# EAGLE design SMA-Q2 replacement board v2.1 (EAGLE 8.6.0)
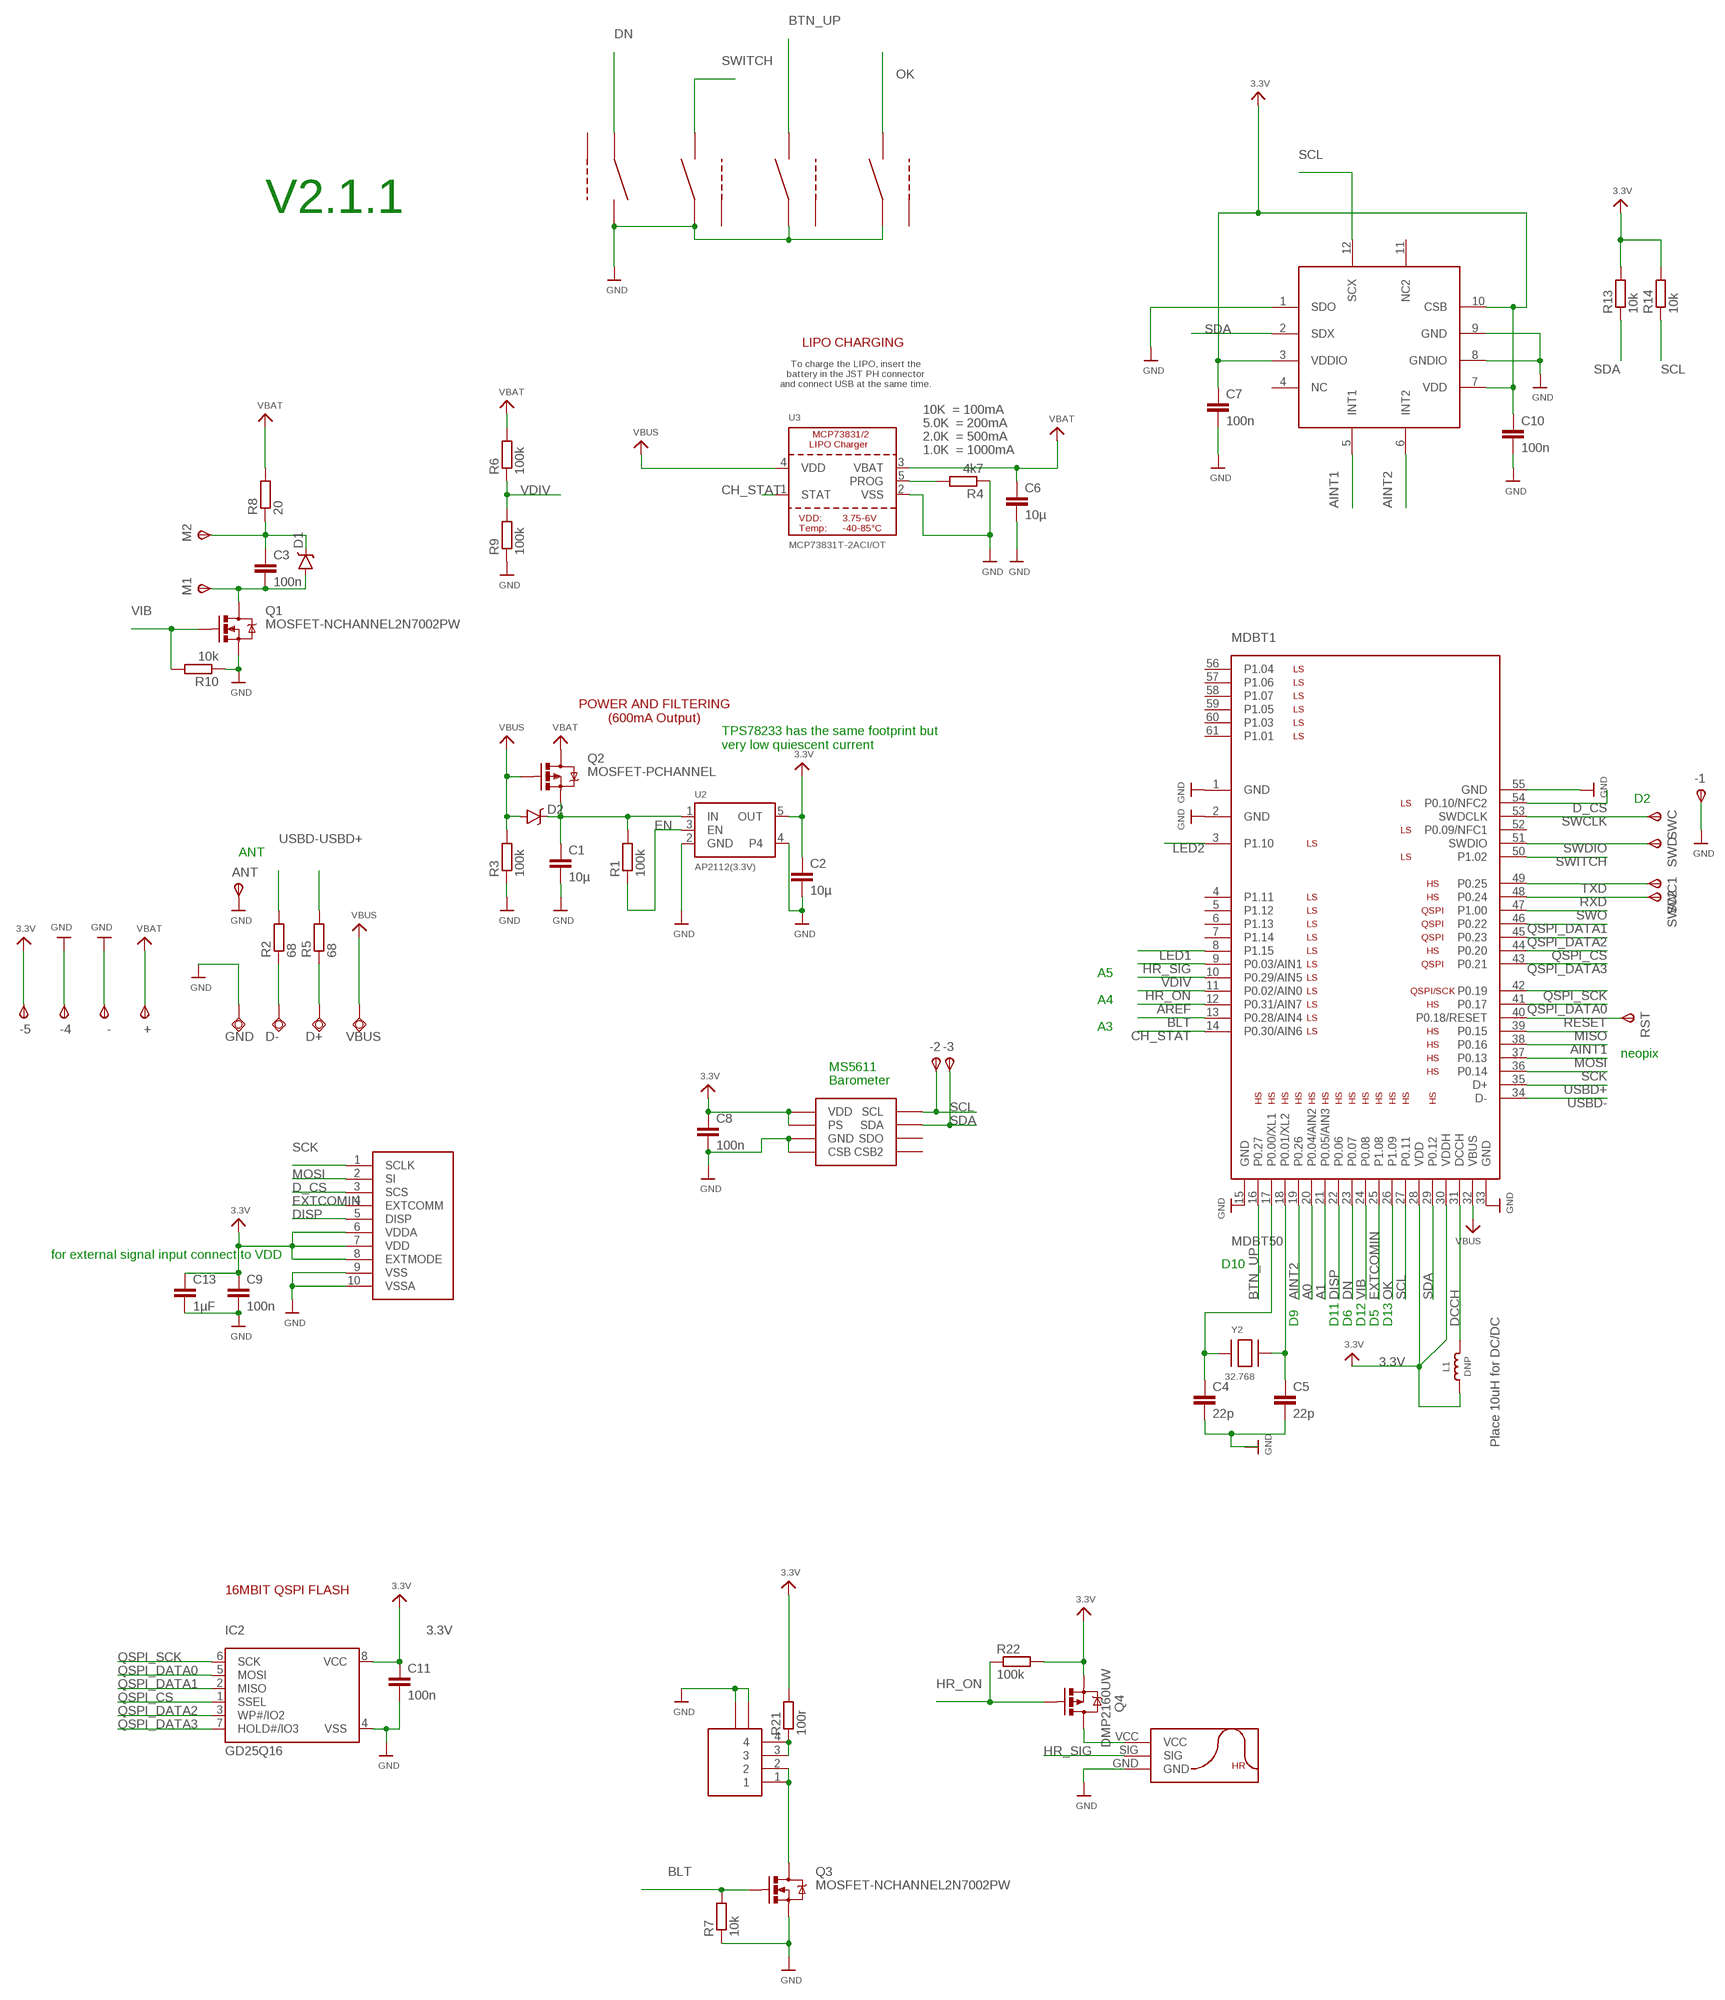
[diagram p0: schematic, sheet 1]

## Parts
+  TPSTP09R  [TP09R]
-  TPSTP09R  [TP09R]
-1  TPSTP09R  [TP09R]
-2  TPSTP09R  [TP09R]
-3  TPSTP09R  [TP09R]
-4  TPSTP09R  [TP09R]
-5  TPSTP09R  [TP09R]
ANT  TPSTP19SQ  [TP19SQ]
C1  10µ  C-EUC0603  [C0603]
C2  10µ  C-EUC0603  [C0603]
C3  100n  C-EUC0402  [C0402]
C4  22p  C-EUC0402  [C0402]
C5  22p  C-EUC0402  [C0402]
C6  10µ  C-EUC0603  [C0603]
C7  100n  C-EUC0402  [C0402]
C8  100n  C-EUC0402  [C0402]
C9  100n  C-EUC0402  [C0402]
C10  100n  C-EUC0402  [C0402]
C11  100n  C-EUC0402  [C0402]
C13  1µF  C-EUC0402  [C0402]
D1  BAT20J  DIODE-SCHOTTKY-BAT20J  [SOD-323]
D2  BAT20J  DIODE-SCHOTTKY-BAT20J  [SOD-323]
D+  TPSQTP20R  [TP20R]
D-  TPSQTP20R  [TP20R]
DWN  LS12T2  [LS12T2]
DWN1  LS12T2  [LS12T2]
DWN2  LS12T2  [LS12T2]
DWN3  LS12T2  [LS12T2]
GND  TPSQTP20R  [TP20R]
IC2  GD25Q16  SPIFLASH_8PINUX  [USON8]
L1  DNP  INDUCTOR_0805MP  [_0805MP]
M1  TPSTP09R  [TP09R]
M2  TPSTP09R  [TP09R]
MDBT1  MDBT50  [MDBT50]
Q1  MOSFET-NCHANNEL2N7002PW  [SOT323]
Q2  MOSFET-PCHANNEL  [SOT23-3]
Q3  MOSFET-NCHANNEL2N7002PW  [SOT323]
Q4  DMP2160UW  MOSFET-P-CHANNEL-DMP2160UW  [SOT323]
R1  100k  R-EU_R0402  [R0402]
R2  68  R-EU_R0402  [R0402]
R3  100k  R-EU_R0402  [R0402]
R4  4k7  R-EU_R0402  [R0402]
R5  68  R-EU_R0402  [R0402]
R6  100k  R-EU_R0402  [R0402]
R7  10k  R-EU_R0402  [R0402]
R8  20  R-EU_R0402  [R0402]
R9  100k  R-EU_R0402  [R0402]
R10  10k  R-EU_R0402  [R0402]
R13  10k  R-EU_R0402  [R0402]
R14  10k  R-EU_R0402  [R0402]
R21  100r  R-EU_R0402  [R0402]
R22  100k  R-EU_R0402  [R0402]
RST  TPSTP09R  [TP09R]
SWC  TPSTP09R  [TP09R]
SWC1  TPSTP09R  [TP09R]
SWC2  TPSTP09R  [TP09R]
SWD  TPSTP09R  [TP09R]
U2  AP2112(3.3V)  VREG_SOT23-5  [SOT23-5]
U3  MCP73831T-2ACI/OT  MCP73831/2  [SOT23-5]
U$2  SHARP_MEM_DISP  [Y5BW]
U$6  Y5B-4PIN  [Y5B-4PIN]
U$7  BMA400  [BMA400]
U$15  MC5611  [MS5611]
U$45  HR_PADS  [HR_PADS]
VBUS  TPSQTP20R  [TP20R]
Y2  32.768  XTAL-3.2X1.5  [XTAL3215]

## Nets
3.3V [power]: -5.TP(PP) C2.1 C7.1 C8.1 C9.1 C10.1 C11.1 C13.1 IC2.8(VCC) L1.1 MDBT1.28(VDD) MDBT1.30(VDDH) Q4.2(S) R13.2 R14.2 R21.2 R22.2 U2.5(OUT) U$2.6(VDDA) U$2.7(VDD) U$2.8(EXTMODE) U$7.3(VDDIO) U$7.7(VDD) U$7.10(CSB) U$15.PS U$15.VDD
A0: MDBT1.20(P0.04/AIN2)
A1: MDBT1.21(P0.05/AIN3)
AINT1: MDBT1.38(P0.16) U$7.5(INT1)
AINT2: MDBT1.19(P0.26) U$7.6(INT2)
AREF: MDBT1.12(P0.31/AIN7)
BLT: MDBT1.13(P0.28/AIN4) Q3.1(G) R7.2
BTN_UP: DWN2.1 MDBT1.16(P0.27)
CH_STAT: MDBT1.14(P0.30/AIN6) U3.1(STAT)
D_CS: MDBT1.54(P0.10/NFC2) U$2.3(SCS)
DCCH: L1.2 MDBT1.31(DCCH)
DISP [power]: MDBT1.22(P0.06) U$2.5(DISP)
DN: DWN.2 MDBT1.23(P0.07)
EN: R1.1 U2.3(EN)
EXTCOMIN: MDBT1.25(P1.08) U$2.4(EXTCOMM)
GND: -1.TP(PP) -4.TP(PP) -.TP(PP) ANT.TP(PP) C1.2 C2.2 C4.2 C5.2 C6.2 C7.2 C8.2 C9.2 C10.2 C11.2 C13.2 DWN1.2 DWN2.2 DWN3.2 DWN.1 GND.TP IC2.4(VSS) MDBT1.1(GND) MDBT1.2(GND) MDBT1.15(GND) MDBT1.33(GND) MDBT1.55(GND) Q1.2(S) Q3.2(S) R3.1 R4.1 R7.1 R9.1 R10.1 U2.2(GND) U2.4 U3.2(VSS) U$2.9(VSS) U$2.10(VSSA) U$6.H1 U$6.H2 U$7.1(SDO) U$7.8(GNDIO) U$7.9(GND) U$15.CSB U$15.GND U$45.GND
HR_ON: MDBT1.11(P0.02/AIN0) Q4.1(G) R22.1
HR_SIG: MDBT1.9(P0.03/AIN1) U$45.SIG
LED1: MDBT1.8(P1.15)
LED2: MDBT1.3(P1.10)
MISO: MDBT1.39(P0.15)
MOSI: MDBT1.37(P0.13) U$2.2(SI)
N$1: Q3.3(D) U$6.1 U$6.2
N$3: D-.TP R2.1
N$4: D+.TP R5.1
N$7: C4.1 MDBT1.17(P0.00/XL1) Y2.P$1
N$8: C5.1 MDBT1.18(P0.01/XL2) Y2.P$2
N$9: R21.1 U$6.3 U$6.4
N$12: R4.2 U3.5(PROG)
N$13: C3.2 D1.A M1.TP(PP) Q1.3(D)
N$14: C3.1 D1.C M2.TP(PP) R8.1
N$17: Q4.3(D) U$45.VCC
OK: DWN3.1 MDBT1.26(P1.09)
QSPI_CS: IC2.1(SSEL) MDBT1.44(P0.20)
QSPI_DATA0: IC2.5(MOSI) MDBT1.41(P0.17)
QSPI_DATA1: IC2.2(MISO) MDBT1.46(P0.22)
QSPI_DATA2: IC2.3(WP#/IO2) MDBT1.45(P0.23)
QSPI_DATA3: IC2.7(HOLD#/IO3) MDBT1.43(P0.21)
QSPI_SCK: IC2.6(SCK) MDBT1.42(P0.19)
RESET: MDBT1.40(P0.18/RESET) RST.TP(PP)
RXD: MDBT1.48(P0.24) SWC2.TP(PP)
SCK: MDBT1.36(P0.14) U$2.1(SCLK)
SCL: -2.TP(PP) MDBT1.27(P0.11) R14.1 U$7.12(SCX) U$15.SCL
SDA: -3.TP(PP) MDBT1.29(P0.12) R13.1 U$7.2(SDX) U$15.SDA
SWCLK: MDBT1.53(SWDCLK) SWC.TP(PP)
SWDIO: MDBT1.51(SWDIO) SWD.TP(PP)
SWITCH: DWN1.1 MDBT1.50(P1.02)
SWO: MDBT1.47(P1.00)
TXD: MDBT1.49(P0.25) SWC1.TP(PP)
USBD+: MDBT1.35(D+) R5.2
USBD-: MDBT1.34(D-) R2.2
VBAT [power]: +.TP(PP) C6.1 Q2.3(D) R6.2 R8.2 U3.3(VBAT)
VBUS [power]: D2.A MDBT1.32(VBUS) Q2.1(G) R3.2 U3.4(VDD) VBUS.TP
VDIV: MDBT1.10(P0.29/AIN5) R6.1 R9.2
VHI [power]: C1.1 D2.C Q2.2(S) R1.2 U2.1(IN)
VIB: MDBT1.24(P0.08) Q1.1(G) R10.2
Unconnected: DWN1.FRAME(FRM) DWN2.FRAME(FRM) DWN3.FRAME(FRM) DWN.FRAME(FRM) MDBT1.4(P1.11) MDBT1.5(P1.12) MDBT1.6(P1.13) MDBT1.7(P1.14) MDBT1.52(P0.09/NFC1) MDBT1.56(P1.04) MDBT1.57(P1.06) MDBT1.58(P1.07) MDBT1.59(P1.05) MDBT1.60(P1.03) MDBT1.61(P1.01) U$7.4(NC) U$7.11(NC2) U$15.CSB2 U$15.SDO

## Notes on the sheet
- V2.1.1
- LIPO CHARGING
- To charge the LIPO, insert the
  battery in the JST PH connector
  and connect USB at the same time.
- 10K  = 100mA
- 5.0K  = 200mA
- 2.0K  = 500mA
- 1.0K  = 1000mA
- POWER AND FILTERING
  (600mA Output)
- TPS78233 has the same footprint but 
  very low quiescent current
- D2
- ANT
- A5
- A4
- A3
- neopix
- MS5611
- Barometer
- for external signal input connect to VDD | D10
- D9 | D11 | D6 | D12 | D5 | D13
- Place 10uH for DC/DC
- 16MBIT QSPI FLASH

## Library data of the parts
+ - -1--5 ANT M1 M2 RST SWC SWC1 SWC2 SWD = testpad:TPS: TEST PIN
C1-C11 C13 = rcl:C-EU: CAPACITOR, European symbol
D1 D2 = SparkFun-DiscreteSemi:DIODE-SCHOTTKY: Schottky diodes in SFE's production catalog BAT20J 1A 23V 0.62Vf RB751 120mA 40V 0.37Vf PMEG4005EJ 0.5A 40V 0.42Vf MBRA140 1A 40V 0.5Vf B340A 3A 40V SMA; PROD_ID: DIO-11623
D+ D- GND VBUS = testpad:TPSQ: Test pad
DWN DWN1-DWN3 = LS12T2:LS12T2
IC2 = microbuilder:SPIFLASH_8PIN: SOIC8 SPI Flash Be careful with the size since SOIC8 flash comes in several 'widths' SOIC8 150 mil M25P16 - 16Mbit (2Mbit x 8) Serial Flash (75MHz SPI Bus), Supply: 2.7-3.6V Digikey: SOIC8 - M25P16-VMN6P-ND SOIC8 208 mil W25Q16BVSSIG - 16Mbit (2Mbit x 8) Serial Flash (104MHz SPI Bus), Supply: 2.7-3.6V Digikey: SOIC8 - W25Q16BVSSIG-ND
L1 = microbuilder:INDUCTOR: Inductors 0603: 10nH Ceramic Inductor - microwire antenna/RF (Digikey: 712-1434-2-ND) 0805: 560nH Ceramic Inductor - RF (Digikey: 553-1047-1-ND) 270nH Ceramic Inductor - Q = 40@250MHz, +-5%, 1 Ohm DC Resistance (Digikey: 535-10506-2-ND) 1007 (2518 Metric) SMT: 10µH 10% 250mOhm 820mA 1007 Inductor (Digikey: 587-2189-1-ND) 22µH 10% 500mOhm 580mA 1007 Inductor (Digikey: 587-2190-1-ND) 47µH 10% 950mOhm 420mA 1007 Inductor (Digikey: 587-2191-1-ND) 47µH 5% 100mOhm 1A 1008 Inductor (Digikey: 732-1816-1-ND) 5.0x5.0mm (Taiyo Yuden NR5040 Series) 6.8µH 20% 2.3A 64mOhm Inductor (Digikey: 587-2374-2-ND) 5.0x5.0mm (TDK VLC5045 Series) 4.7µH 20% 3.3A 34mOhm Inductor (Digikey: 445-6526-1-ND) 6.8µH 20% 2.7A 46mOhm Inductor (Digikey: 445-6527-1-ND) 6.0x6.0mm (TDK VLC6045 Series) 4.7µH 20% 3.8A 27mOhm Inductor (Digikey: 445-6538-2-ND) 6.8µH 20% 3A 41mOhm Inductor (Digikey: 445-6540-1-ND) 6.2µH 30% 2.2A 45mOhm Inductor (Digikey: SRR5028-6R2YCT-ND) - Not TDK VLC6045 but footprint should match 6.0x6.0mm (TDK SLF6045 Series) 6.8uH 30% 2A 33mOhm Inductor (Digikey: 445-4572-1-ND, Mouser: 810-SLF645T6R8N2R0PF) 6.0x6.0mm (Sumida CDRH5D28 Series) 6.2uH 30% 1.8A 45mOhm Inductor (Digikey: 308-1542-1-ND) Taiyo Yuden NR3015T2R2M - 2.2uH 20% 1.5A (Digikey: 587-1648-2-ND, Mouser: 963-NR3015T2R2M) - Used with TI TPS62172 CoilCraft RFID Transponder Coil - MA5532-AE (For use with AS3935 Lightning Sensor) Taiyo Yuden NRH2412T2R2MNGH - 2.2uH 20% 1AA (Digikey: 587-3443-1-ND) - Used with TI LM3671 Vishay IHLP 1.0uH Molded Inductor - 24mOhm DCR, 5A, +/-20%, -55°C-125°C (Digikey: 541-1319-1-ND)
MDBT1 = microbuilder:MDBT50: Raytac Corporation MDBT50 Bluetooth Low Energy Module based on Noridc nRF52840 Source: Raytac datasheet
Q1 Q3 = SparkFun-DiscreteSemi:MOSFET-NCHANNEL: Common NMOSFET Parts MFG P/N Store ID Prod ID FDD8780 TRANS-09984 SI7820DN TRANS-11055 FDS6630A IC-08089 2N7002PW TRANS-11151 FQP30N06L COM-10213 TRANS-10060 BSS123LT1G TRANS-08345 BSS138 TRANS-00830 BS170 2N7000; PROD_ID: TRANS-11151
Q2 = SparkFun-DiscreteSemi:MOSFET-PCHANNEL: Generic PMOSFET IRLML2244 - TRANS-11153 (SOT-23 -20V -4.3A) (1.Gate 2.Source 3.Drain) FQP27P06 - COM-10349 <http://www.sparkfun.com/products/10349> (TO-220 -60V -27A) (1.Gate 2.Source 3.Drain); PROD_ID: TRANS-08285
Q4 = TSEM_R2A:MOSFET-P-CHANNEL: MOSFET P Channel; FARNELL_OC: 1858672
R1-R10 R13 R14 R21 R22 = rcl:R-EU_: RESISTOR, European symbol
U2 = microbuilder:VREG_SOT23-5: SOT23-5 Fixed Voltage Regulators Part Current Out V Out V In V Dropout θJA (°C/W) TJ (°C) Digikey Part No. ADP121 150mA 3.3V 3.4-5.5V 0.09V @ 150mA -- -- ADP121-AUJZ33R7CT-ND ADP121 150mA 3.0V 3.1-5.5V 0.09V @ 150mA -- -- ADP121-AUJZ30R7CT-ND ADP122 300mA 3.3V 3.4-5.5V 0.085V @ 300mA -- -- ADP122AUJZ-3.3-R7CT-ND ADP1712 300mA 3.3V 3.5-5.5V 0.17V @ 300mA -- -- ADP1712AUJZ-3.3-R7TR-ND AP7311 (Low Cost) 150mA 3.3V 3.5-6V 0.15V @ 150mA -- -- AP7311-33WG-7DICT-ND LD39015M18R 150mA 1.8V 1.9V-5.5V 0.08V @ 100mA -- -- 497-6977-1-ND LP2985A-33DBVR 150mA 3.3V 3.3-16V 0.28V @ 150mA 206 150 296-18479-1-ND MCP1824T-3302E/OT 300mA 3.3V 3.5V-6V 0.2V @ 300mA -- -- MCP1824T-3302E/OTCT-ND MIC5205-2.5YM5 TR 150mA 2.5V 2.7-16V 0.165V @ 150mA -- -- 576-1257-2-ND MIC5205-3.0YM5 TR 150mA 3.0V 3.2V-16V 0.165V @ 150mA -- -- 576-1258-2-ND MIC5205-3.3YM5 TR 150mA 3.3V 3.5V-16V 0.165V @ 150mA -- -- 576-1259-2-ND TPS780330220 150mA 3.3V+2.2V 3.6-5.5V 250mV Max -- -- 296-23332-1-ND TDA3663/N1,135 100mA 3.3V 3.5-45V 0.18V @ 50mA -- -- 568-5343-1-ND Max operating temp can be calculated using θJA, TJ (max junction temperature), and power in watts. Set the "Maximum Ambient Temperature" until it reaches TJ ("Max Junction Temperature"), which is the absolute limit for safe use of the regulator: Heat Sink Temperature Calculator <http://www.daycounter.com/Calculators/Heat-Sink-Temperature-Calculator.phtml> For example, With 12V source into a 3.3V LP2985 and a 30mA load, we are dissipating (12V-3.3V) * 0.03A = 0.261W. With a θJA of 206 °C/W, a TJ of 150°C, and 261mW we can safely use the chip without a heat sink up to 75°C (=147.1°C Junction Temperature).
U3 = microbuilder:MCP73831/2: MCP73831/2 LIPO Charger VDD: 3.75 - 6V Temp -40 - 85°C Programmable Charge Rate: 15-500mA NOTE: STAT is a tri-state logic output on the MCP73831 and an open-drain output on the MCP73832. SOT23-5 with 4.2V output and tri-state logic on STAT = MCP73831T-2ACI/OT
U$2 = AYF531035:SHARP_MEM_DISP
U$6 = Y5B-4pin:Y5B-4PIN
U$7 = BMA400:BMA400
U$15 = MS5611:MC5611
U$45 = HR_pads:HR_PADS
Y2 = adafruit2:XTAL: Low cost SMT crystals, no capacitors included http://www.ladyada.net/library/eagle

## Net classes
1 power: width 0.254 mm

## Board
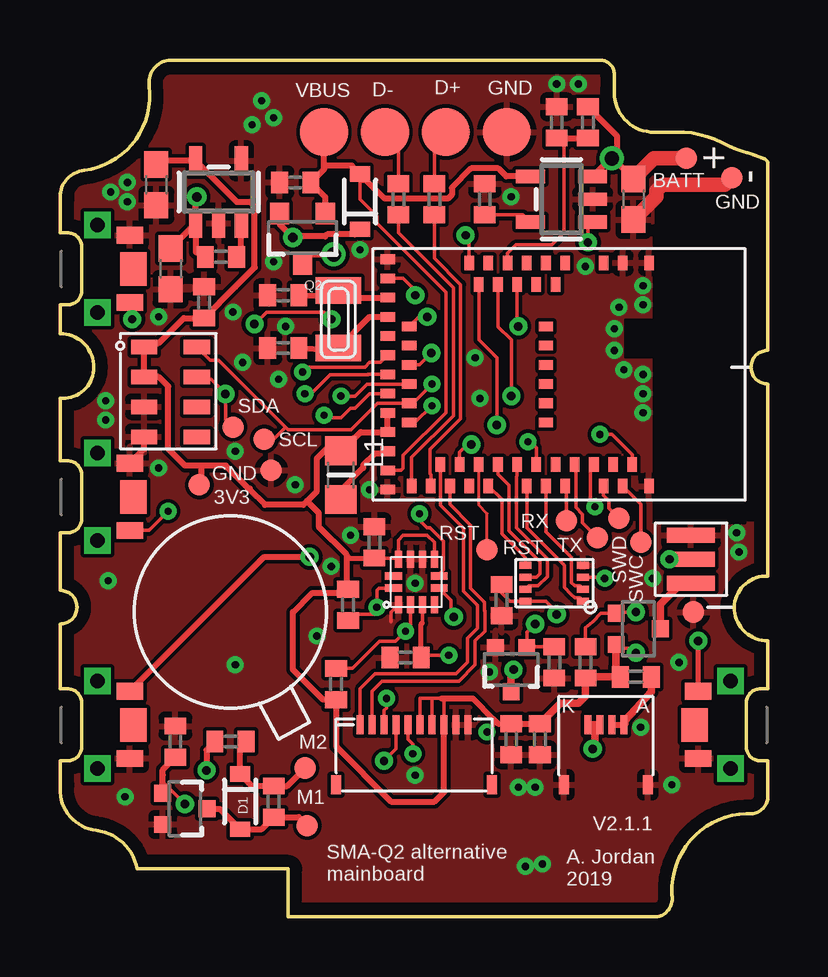
[diagram p1: board, top side]
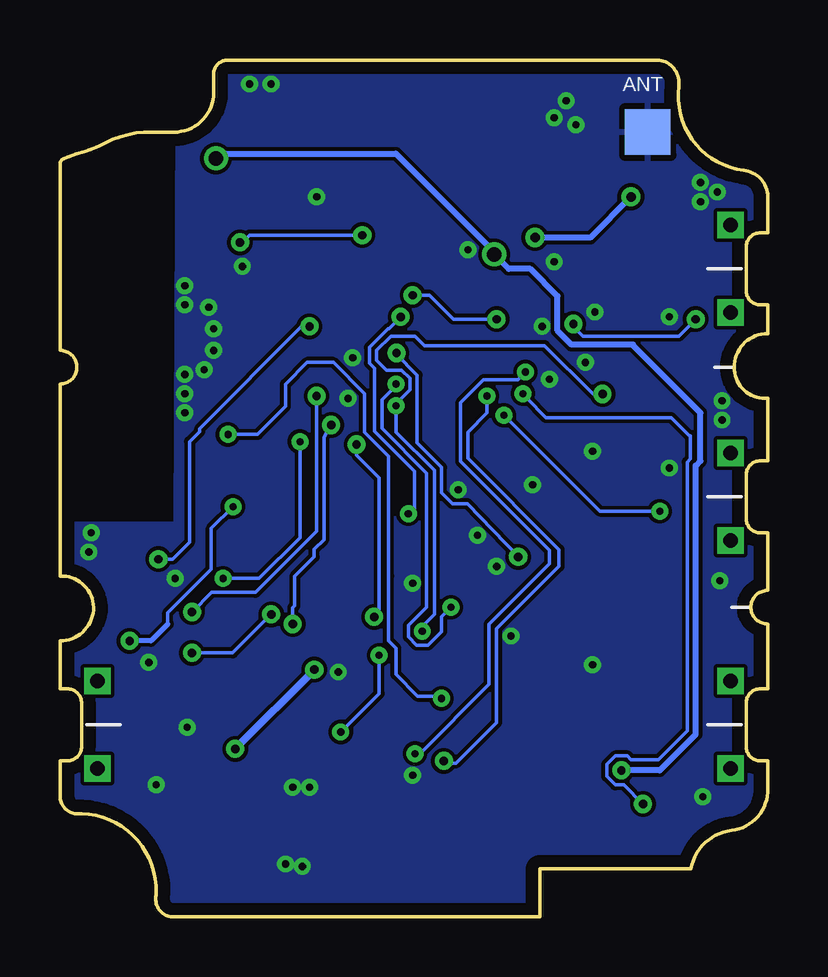
[diagram p2: board, bottom side, seen from below]

Size 29.52 x 35.7 mm. Coordinates in mm from the lower left corner, seen from the top.
Outline: 0.01,5.5 0.01,6.5 0.31,6.5 arc90 0.91,7.1 0.91,8.9 arc90 0.31,9.5 0.01,9.5 0.01,12.2 arc90 0.71,12.9 arc90 0.01,13.6 0.01,16 0.31,16 arc90 0.91,16.6 0.91,18.4 arc90 0.31,19 0.01,19 0.01,21.6 0.11,21.6 arc90 1.41,22.9 arc90 0.01,24.3 0.01,25.5 0.31,25.5 arc90 0.91,26.1 0.91,27.9 arc90 0.31,28.5 0.01,28.5 0.01,29.9 arc-90 1.01,31.1 arc90 3.71,34.6 3.71,34.7 arc-90 4.61,35.7 22.51,35.7 arc-90 23.11,35.1 23.11,34.5 arc90 24.61,32.7 26.01,32.7 arc-25 27.91,32.1 arc8 28.81,31.8 29.31,31.6 arc-90 29.51,31.3 29.51,23.6 arc90 28.81,22.9 arc90 29.51,22.2 29.51,14.2 arc90 28.11,12.9 arc90 29.51,11.5 29.51,9.5 29.21,9.5 arc90 28.61,8.9 28.61,7.1 arc90 29.21,6.5 29.51,6.5 29.51,4.9 arc-90 28.61,4.3 arc90 25.51,1 25.51,0.9 arc-90 24.91,0 9.51,0 9.51,2 3.21,2 arc73 1.51,3.6 arc-90 0.01,5.5
Copper layers (1*16): Top 0.035mm / dielectric 1.5mm / Bottom 0.035mm
Design rules "default *": minimum track width 6mil, minimum drill 0.35mm, track to track 6mil, track to pad 6mil, pad to pad 6mil, via to via 6mil, smd to smd 6mil, copper to edge 20mil, drill to drill 6mil, minimum pad ring 10mil, minimum via ring 8mil, stop-mask expansion 4mil, vias tented up to drill 20mil, thermal gap 10mil

### Footprints (pad centres in the part's own frame; a part is rotated, then mirrored left to right if it is on the bottom)
TP09R = smd 0.9 x 0.9: TP 0,0
TP19SQ = smd 1.9 x 1.9: TP 0,0
C0603 = smd 1.1 x 1: 1 -0.85,0; 2 0.85,0
C0402 = smd 0.7 x 0.9: 1 -0.65,0; 2 0.65,0
SOD-323 = smd 0.63 x 0.83: A 1.15,0; C -1.15,0
TP20R = smd 2 x 2: TP 0,0
LS12T2 = smd 1.1 x 0.7: 1 0,1.4; 2 0,-1.4 | smd 1.1 x 1.4: FRAME -0.15,0 | drill 0.6 pad 1.016 square: P$4 1.35,-1.825; P$5 1.35,1.825
USON8 = smd 0.5 x 0.275: 1 -1.2,0.75; 2 -1.2,0.25; 3 -1.2,-0.25; 4 -1.2,-0.75; 5 1.2,-0.75; 6 1.2,-0.25; 7 1.2,0.25; 8 1.2,0.75
_0805MP = smd 1.2 x 1.3: 1 -1.016,0; 2 1.016,0
MDBT50 = smd 0.6 x 0.4: 1 -4.65,3.75; 2 -4.65,2.65; 3 -4.65,1.85; 4 -4.65,0.25; 5 -3.75,-0.15; 6 -4.65,-0.55; 7 -3.75,-0.95; 8 -4.65,-1.35; 9 -3.75,-1.75; 10 -4.65,-2.15; 11 -3.75,-2.55; 12 -4.65,-2.95; 13 -3.75,-3.35; 14 -4.65,-3.75; 34 4.65,-6.15; 35 4.65,-5.35; 36 3.75,-4.95; 37 4.65,-4.55; 38 3.75,-4.15; 39 4.65,-3.75; 40 3.75,-3.35; 41 4.65,-2.95; 42 3.75,-2.55; 43 3.75,-1.75; 44 4.65,-1.35; 45 3.75,-0.95; 46 4.65,-0.55; 47 3.75,-0.15; 48 4.65,0.25; 49 3.75,0.65; 50 3.75,1.45; 51 4.65,1.85; 52 3.75,2.25; 53 4.65,2.65; 54 3.75,3.05; 55 4.65,3.75 | smd 0.4 x 0.6: 15 -4.8,-7.15; 16 -4,-7.15; 17 -3.2,-7.15; 18 -2.4,-7.15; 19 -2,-6.25; 20 -1.6,-7.15; 21 -1.2,-6.25; 22 -0.8,-7.15; 23 -0.4,-6.25; 24 0,-7.15; 25 0.4,-6.25; 26 0.8,-7.15; 27 1.2,-6.25; 28 1.6,-7.15; 29 2,-6.25; 30 2.4,-7.15; 31 3.2,-7.15; 32 4,-7.15; 33 4.8,-7.15; 56 -2,-0.55; 57 -1.2,-0.55; 58 -0.4,-0.55; 59 0.4,-0.55; 60 1.2,-0.55; 61 2,-0.55
SOT323 = smd 0.7 x 0.7: 1 -0.65,-0.925; 2 0.65,-0.925; 3 0,0.925
SOT23-3 = smd 0.8 x 0.9: 1 -0.95,-1; 2 0.95,-1; 3 0,1.1
R0402 = smd 0.7 x 0.9: 1 -0.65,0; 2 0.65,0
SOT23-5 = smd 0.55 x 1.2: 1 -0.95,-1.3; 2 0,-1.3; 3 0.95,-1.3; 4 0.95,1.3; 5 -0.95,1.3
Y5BW = smd 0.3 x 0.8: 1 -2.25,0; 2 -1.75,0; 3 -1.25,0; 4 -0.75,0; 5 -0.25,0; 6 0.25,0; 7 0.75,0; 8 1.25,0; 9 1.75,0; 10 2.25,0 | smd 0.4 x 0.8: P$11 -3.25,-2.5; P$12 3.25,-2.5
Y5B-4PIN = smd 0.3 x 0.8: 1 1,2.5; 2 1.5,2.5; 3 2,2.5; 4 2.5,2.5 | smd 0.4 x 0.8: H1 0,0; H2 3.5,0
BMA400 = smd 0.3 x 0.7: 1 0,-0.2; 2 0.5,-0.2; 3 1,-0.2; 4 1.5,-0.2; 7 1.5,1.7; 8 1,1.7; 9 0.5,1.7; 10 0,1.7 | smd 0.7 x 0.3: 5 1.7,0.5; 6 1.7,1; 11 -0.2,1; 12 -0.2,0.5
MS5611 = smd 1.1 x 0.6: CSB 0,0; CSB2 2.2,0; GND 0,1.25; PS 0,2.5; SCL 2.2,3.75; SDA 2.2,2.5; SDO 2.2,1.25; VDD 0,3.75
HR_PADS = smd 2 x 0.635: GND 0,-1; SIG 0,0; VCC 0,1
XTAL3215 = smd 1.1 x 1.9: P$1 1.2,0; P$2 -1.2,0

### Placement (x,y rotation side)
+  26.11,31.6 270 top
-  28.01,30.8 270 top
-1  26.41,12.7 0 top
-2  8.51,19.9 0 top
-3  7.21,20.4 0 top
-4  8.81,18.6 0 top
-5  5.81,18 0 top
ANT  5.01,32.7 0 bottom
C1  4.61,27 270 top
C2  4.01,30.5 270 top
C3  8.91,4.8 270 top
C4  9.31,25.9 180 top
C5  9.31,23.7 180 top
C6  23.91,29.9 270 top
C7  14.41,10.8 180 top
C8  6.01,25.6 90 top
C9  18.81,7.4 270 top
C10  13.11,15.6 90 top
C11  18.41,13.2 270 top
C13  20.01,7.4 270 top
D1  7.51,4.8 270 top
D2  12.51,29.8 90 top
D+  16.09,32.7 90 top
D-  13.55,32.7 90 top
DWN  2.91,8 180 top
DWN1  26.61,8 0 top
DWN2  2.91,27 180 top
DWN3  2.91,17.5 180 top
GND  18.63,32.7 0 top
IC2  20.61,13.9 180 top
L1  11.71,18.4 270 top
M1  10.31,3.8 0 top
M2  10.21,6.2 0 top
MDBT1  20.81,22.6 270 top
Q1  5.21,4.5 270 top
Q2  10.11,28.3 180 top
Q3  18.81,10.3 180 top
Q4  24.11,12 270 top
R1  6.71,27.5 180 top
R2  14.11,29.9 270 top
R3  9.81,30.6 0 top
R4  17.71,29.9 270 top
R5  15.61,29.9 270 top
R6  22.01,33.1 90 top
R7  20.61,10.6 90 top
R8  7.11,7.3 180 top
R9  20.71,33.1 270 top
R10  4.81,7.3 270 top
R13  11.51,9.7 270 top
R14  12.01,13 90 top
R21  24.01,10 180 top
R22  21.91,10.6 270 top
RST  17.81,15.3 0 top
SWC  24.21,15.6 0 top
SWC1  22.41,15.8 0 top
SWC2  21.11,16.5 0 top
SWD  23.31,16.6 0 top
U2  6.61,30.2 0 top
U3  20.91,29.9 90 top
U$2  14.76,8 0 top
U$6  21.01,5.5 0 top
U$7  14.11,13.2 0 top
U$15  3.51,20 0 top
U$45  26.31,14.9 180 top
VBUS  11.01,32.7 90 top
Y2  11.61,24.9 90 top

### Tracks (layer width: path | path; a pad name or v marks a point on that pad's centre or on a via)
3.3V  (via drill 0.3, 0.35)
  Top 0.152: 15.51,9.1 15.01,9.1 U$2.6 | 15.51,9.1 15.91,9.1 16.01,9 U$2.8 | U$2.7 15.51,9.1 | v20.71,12.6 20.81,12.6 20.26,13.15 IC2.8 18.76,13.15 18.41,13.5 C11.1 | v24.01,11 23.81,11.2 23.19,11.2 | 15.11,12.25 U$7.3 | 11.94,15.1 12.09,14.95 | C10.1 14.06,14.95 U$7.10 14.11,15.7 14.31,15.9 15.31,15.9 15.61,15.6 U$7.7 | C7.1 15.16,10.9 v16.21,10.9 | 18.06,8.25 18.06,7.95 v17.81,7.7
  Top 0.2: C7.1 15.06,12.2 15.11,12.25
  Top 0.203: 11.71,19.39 11.71,19.4 L1.1 | 12.09,14.95 C10.1
  Top 0.254: C2.1 4.06,31.5 U2.5 7.38,29.78 7.95,29.78 8.12,29.62 8.12,27.06 7.31,26.25 C8.1 | U$2.8 16.01,5.2 15.61,4.8 13.81,4.8 11.51,7.1 R13.2 10.96,9.05 9.71,10.3 9.71,12.7 10.51,13.5 11.86,13.5 R14.2 11.94,13.72 11.94,15.1 10.78,16.26 10.78,16.83 10.29,17.32 | C13.1 C9.1 18.26,8.05 18.06,8.25 17.21,9.1 15.91,9.1 | 7.89,17.82 8.55,17.17 10.14,17.17 10.29,17.32 | MDBT1.28 MDBT1.30 12.54,20.2 12.29,19.94 12.24,19.94 L1.1 | 7.89,17.82 7.91,17.84 | 11.71,19.4 11.21,19.4 11.11,19.5 10.71,19.1 10.71,17.73 10.29,17.32 | C8.1 6.16,25.1 | 7.89,17.82 6.92,18.8 5.91,18.8 | 5.91,18.8 5.21,18.8 4.51,19.5 4.51,22.1 4.11,22.5 U$15.PS U$15.VDD 3.66,23.9 4.11,23.9 5.16,24.95 C8.1 | -5.TP 5.91,18.1 5.91,18.8
  Top 0.305: C13.1 20.86,8.9 21.61,8.9 21.91,9.2 R22.2 21.86,10 R21.2 23.19,10.03 23.19,11.2 Q4.2
  Bottom 0.152: v20.71,12.6 22.31,11 v24.01,11 | v17.81,7.7 16.21,9.3 v16.21,10.9
AINT1  (via drill 0.35)
  Top 0.152: U$7.5 16.31,13.2 16.31,12.5 v16.42,12.5 | MDBT1.38 16.66,19.35 17.01,19.7 17.03,19.68 v17.15,19.68
  Bottom 0.152: v17.15,19.68 17.15,19.24 16.21,18.3 16.21,12.71 v16.42,12.5
AINT2  (via drill 0.3, 0.35)
  Top 0.152: MDBT1.19 14.96,25 v15.31,25 | U$7.6 15.81,14.28 15.99,14.46 15.99,15.65 15.44,16.2 15.31,16.2 15.01,16.5 15.01,16.78 v14.99,16.8
  Bottom 0.152: v15.31,25 15.81,24.5 15.84,24.5 16.62,23.73 16.62,23.07 16.4,22.86 16.4,20.22 14.74,18.57 14.74,16.87 14.81,16.8 v14.99,16.8
BLT  (via drill 0.35)
  Top 0.152: MDBT1.13 17.46,24.05 18.21,23.3 v18.21,20.49 | v19.81,12.2 19.46,11.85 Q3.1 19.49,11.25 R7.2
  Bottom 0.152: 18.21,20.4 v18.21,20.49 18.51,19.99 18.51,15.72 18.92,15.32 18.92,14.99 19.73,14.18 19.73,12.96 19.81,12.88 19.81,12.38 19.81,12.3 v19.81,12.2
BTN_UP  (via drill 0.35)
  Top 0.152: DWN2.1 2.91,24.9 3.01,24.8 v3.01,24.9 | v8.11,24.7 8.61,25.2 11.01,25.2 v11.31,24.9 | MDBT1.16 14.31,26.6 14.81,26.1 v14.81,25.9
  Bottom 0.152: v3.01,24.9 3.71,24.2 7.71,24.2 8.11,24.6 v8.11,24.7 | v11.31,24.9 13.11,24.9 14.11,25.9 v14.81,25.9
CH_STAT  (via drill 0.35)
  Top 0.152: MDBT1.14 17.06,28.25 v16.91,28.4 | v22.01,28.1 22.01,28.75 U3.1
  Bottom 0.152: v22.01,28.1 21.91,28.1 21.61,28.4 v16.91,28.4
D_CS  (via drill 0.3)
  Top 0.152: v13.61,9.1 13.61,8.7 13.51,8.6 U$2.3 | MDBT1.54 23.86,19.25 23.01,20.1 v22.51,20.1
  Bottom 0.152: v13.61,9.1 13.61,9.2 14.61,9.2 15.51,10.1 15.51,11.2 15.81,11.5 15.81,14.2 15.81,19.2 16.81,20.2 16.81,21.8 18.11,23.1 19.21,23.1 20.11,22.2 20.11,21.27 21.28,20.1 v22.51,20.1
DCCH
  Top 0.254: MDBT1.31 13.56,19.3 13.11,19.3 12.64,18.83 12.64,18.7 11.71,17.77 L1.2
DISP  (via drill 0.3)
  Top 0.152: MDBT1.22 13.36,23.1 12.91,23.1 12.71,22.9 10.31,22.9 v10.11,22.7 | v14.71,6.8 14.71,7.2 14.51,7.4 U$2.5
  Bottom 0.152: v10.11,22.7 10.43,22.38 11.85,22.38 12.82,21.42 12.82,18.97 9.11,15.27 9.11,14.71 11.62,12.2 11.62,9.69 14.51,6.8 v14.71,6.8
DN  (via drill 0.35)
  Top 0.152: v15.49,23.49 14.99,23 MDBT1.23
  Top 0.254: DWN.2 8.51,15 v10.41,15
  Bottom 0.152: v10.41,15 12.53,17.22 13.15,17.22 13.61,17.67 13.61,18.73 14.62,19.74 14.62,22.57 15.51,23.45 15.51,23.5 15.49,23.5 v15.49,23.49
EN
  Top 0.254: R1.1 7.56,27.5 U2.3
EXTCOMIN  (via drill 0.3, 0.35)
  Top 0.152: U$2.4 14.01,7 v13.51,6.5 | MDBT1.25 13.51,22.2 13.21,22.2 12.81,22.2 12.31,21.7 v11.71,21.7
  Bottom 0.152: v13.51,6.5 13.41,6.4 13.01,6.4 11.32,8.1 11.32,11.99 8.71,14.6 8.71,15.3 12.51,19.1 12.51,20.2 11.71,21 v11.71,21.7
GND  (via drill 0.3)
  Top 0.152: U$7.1 13.81,12.7 13.81,12.3
  Top 0.254: DWN3.2 3.51,19.5 U$15.CSB
  Top 0.61: -.TP 27.71,30.5 25.11,30.5 24.87,30.26 24.87,30.01 C6.2
  other vias: 24.31,21 14.81,13.9 7.31,10.5 4.11,25 2.81,30.6 2.81,29.8 12.51,27.8 8.91,33.3 28.21,16 28.31,15.2 24.21,7.9 25.51,5.5 19.11,5.4 19.81,5.4 12.91,17.8 14.81,5.9 17.91,10.2 20.11,2.2 19.41,2.1 17.31,23.3 4.11,18.7 18.81,30 24.31,21.8 24.31,22.6 24.31,25.5 24.31,26.3 21.91,27.1 20.71,34.7 9.11,22.4 8.01,33 21.61,34.7 25.81,10.6 2.01,14 2.71,5 8.41,34 23.31,25.4 23.11,24.5 23.11,23.6 23.51,22.8 2.11,30.2 8.91,27.3 1.91,20.7 7.31,19.4 9.81,18 7.61,23.1 24.71,14.1 11.31,14.6 7.21,25.2 9.41,24.6 1.91,21.5 17.51,21.6 12.11,15.9 10.71,11.7
  pour Top: -0.39,0.1 -0.39,36.1 24.71,36.1 24.71,16.4 30.01,16.4 30.01,-0.4 7.01,-0.4 -0.39,-0.4
  pour Bottom: -0.99,-1 -0.99,37.4 24.61,37.4 24.71,16.4 30.81,16.4 30.81,-1
HR_ON  (via drill 0.35)
  Top 0.152: v18.82,21.7 18.82,24.04 18.26,24.59 MDBT1.11 | v24.01,12.7 23.24,12.7 Q4.1 22.56,12.65 22.21,12.3 21.91,12.05 R22.1
  Bottom 0.152: v18.82,21.7 v18.81,21.7 v18.82,21.69 18.82,16.06 21.36,13.52 23.19,13.52 v24.01,12.7
HR_SIG  (via drill 0.35)
  Top 0.152: 26.31,14.8 U$45.SIG v25.41,14.9 | v19.11,24.6 19.06,24.65 MDBT1.9
  Bottom 0.152: v19.11,24.6 19.43,24.6 23.69,20.34 23.69,20.22 24.11,19.8 24.11,15.6 24.81,14.9 v25.41,14.9
MOSI
  Top 0.152: MDBT1.37 16.26,17.18 17.12,16.32 17.12,13.69 17.7,13.11 17.7,12.75 17.71,12.74 17.71,11.9 17.31,11.5 17.31,10.5 16.63,9.82 13.43,9.82 13.01,9.4 U$2.2
N$1  (via drill 0.35)
  Top 0.305: U$6.1 22.31,8 | 22.31,8 U$6.2 | 22.31,8 22.31,7.1 v22.21,7 | v18.91,10.3 18.81,10.2 Q3.3
  Bottom 0.305: v22.21,7 v18.91,10.3
N$3
  Top 0.152: R2.1 14.11,32.14 D-.TP
N$4
  Top 0.152: R5.1 15.61,32.22 D+.TP
N$7
  Top 0.254: MDBT1.17 11.91,25.8 Y2.P$1 11.36,25.85 C4.1
N$8
  Top 0.254: MDBT1.18 12.91,25 Y2.P$2 11.21,23.7 11.16,23.65 C5.1
N$9
  Top 0.254: U$6.3 U$6.4
  Top 0.305: U$6.4 23.55,8.04 23.55,8.17 24.66,9.38 R21.1
N$12
  Top 0.152: R4.2 19.31,29.25 U3.5
N$13
  Top 0.254: M1.TP 9.96,4.15 C3.2 8.41,3.65 D1.A 6.66,4.5 Q1.3
N$14
  Top 0.254: R8.1 7.51,7.05 D1.C 8.01,5.45 C3.1 9.46,5.45 M2.TP
N$17
  Top 0.305: Q4.3 25.04,13.03 25.91,13.9 U$45.VCC
OK  (via drill 0.3)
  Top 0.152: MDBT1.26 12.91,21.8 12.31,21.2 12.11,21.2 11.71,20.8 11.01,20.8 v11.01,20.9 | v4.51,16.9 3.71,16.1 DWN3.1
  Bottom 0.152: v11.01,20.9 7.01,16.9 v4.51,16.9
QSPI_CS
  Top 0.152: MDBT1.44 19.46,16.21 21.03,14.65 21.03,13.72 21.33,13.42 21.47,13.28 21.68,13.28 IC2.1
QSPI_DATA0
  Top 0.152: MDBT1.41 18.42,17.39 18.42,15.96 18.95,15.43 19.05,15.33 19.41,14.97 IC2.5
QSPI_DATA1
  Top 0.152: MDBT1.46 20.26,16.05 21.33,14.98 21.33,13.92 21.47,13.78 21.68,13.78 IC2.2
QSPI_DATA2  (via drill 0.3)
  Top 0.152: MDBT1.45 19.86,19.55 19.61,19.8 v19.51,19.8 | v22.71,14.1 22.66,14.15 IC2.3
  Bottom 0.152: v19.51,19.8 19.51,15.8 21.21,14.1 v22.71,14.1
QSPI_DATA3
  Top 0.152: MDBT1.43 19.06,18.37 19.03,18.34 19.03,16.21 20.32,14.93 20.32,14.17 19.93,13.78 19.55,13.78 IC2.7
QSPI_SCK
  Top 0.152: MDBT1.42 18.26,18.45 18.73,17.98 18.73,16.08 20.01,14.8 20.01,14.3 19.86,14.15 IC2.6
RESET
  Top 0.127: RST.TP 17.81,16.8 17.46,17.15 MDBT1.40
RXD
  Top 0.152: MDBT1.48 21.11,17.9 SWC2.TP
SCK
  Top 0.152: MDBT1.36 15.86,17.15 16.82,16.2 16.82,13.56 17.4,12.98 17.4,12.62 17.41,12.62 17.41,12.02 17,11.61 17,10.62 16.5,10.12 13.13,10.12 12.51,9.5 U$2.1
SCL  (via drill 0.3)
  Top 0.152: v15.51,22.2 14.71,21.4 MDBT1.27 13.24,21.4 12.14,20.3 9.51,20.3 9.41,20.4 | U$7.12 13.31,13.7 13.21,13.6 v13.21,12.9 13.21,12.6 12.26,12.6 R14.1 | U$15.SCL 6.26,23.2 6.61,23.2 9.41,20.4 | -2.TP 8.91,19.9 9.41,20.4
  Bottom 0.152: v13.21,12.9 13.61,12.51 13.61,11.88 14.17,11.32 14.65,11.32 14.99,11.66 14.99,12.14 14.23,12.9 14.23,18.49 16.09,20.35 16.09,21.54 15.51,22.12 v15.51,22.2
SDA  (via drill 0.3, 0.35)
  Top 0.152: U$7.2 14.61,12.2 14.41,12 v14.41,11.9 13.99,11.48 13.32,11.48 12.19,10.35 R13.1 | v15.51,21.3 14.81,20.6 MDBT1.29 | U$15.SDA 5.81,22.4 6.31,22.4 v6.91,21.8 v6.9,21.79 6.9,20.71 -3.TP
  Bottom 0.152: v14.41,11.9 14.41,12.1 13.91,12.6 13.91,18.6 15.51,20.2 v15.51,21.3 15.51,21.38 14.93,21.96 14.93,22.44 15.27,22.78 15.89,22.78 16.31,23.2 16.31,23.6 15.71,24.2 14.71,24.2 14.31,23.8 9.31,23.8 7.3,21.79 v6.9,21.79
SWCLK
  Top 0.152: MDBT1.53 24.21,17.2 SWC.TP
SWDIO
  Top 0.152: 23.21,16.6 SWD.TP 22.89,17.02 22.89,17.34 22.66,17.57 MDBT1.51
SWITCH  (via drill 0.3, 0.35)
  Top 0.152: v22.3,17.09 22.11,17.28 22.11,18.7 MDBT1.50
  Top 0.2: 26.61,9.8 v26.61,11.5
  Top 0.203: DWN1.1 26.61,9.8
  Bottom 0.152: 25.02,12.19 25.02,12.2 25.02,12.68 23.21,14.49 23.21,16.18 v22.3,17.09
  Bottom 0.2: 25.02,12.2 25.72,11.5 v26.61,11.5
TXD
  Top 0.152: MDBT1.49 21.51,18.8 21.51,17.06 21.79,16.78 21.79,16.42 SWC1.TP
USBD+
  Top 0.152: MDBT1.35 15.46,18.43 15.43,18.45 15.43,19.49 16.7,20.76 16.7,26.34 15.61,27.43 R5.2
USBD-
  Top 0.152: MDBT1.34 14.66,19.15 16.4,20.88 16.4,26.21 14.11,28.5 R2.2
VBAT  (via drill 0.35, 0.6)
  Top 0.152: Q2.3 10.51,27.6 10.61,27.6
  Top 0.254: U3.3 23.21,31.85 v23.01,31.6 23.14,31.5 | 23.14,31.5 23.21,31.45 C6.1 | R6.2 23.21,32.55 23.21,31.58 23.14,31.5 | 10.46,27.6 10.61,27.6 v11.41,27.6 | R8.2 6.11,6.95 v6.11,6.1
  Top 0.61: C6.1 24.76,31.6 +.TP
  Bottom 0.254: v6.11,6.1 4.51,6.1 3.01,7.6 3.01,18.8 2.81,19 2.81,21 5.63,23.81 5.63,23.84 8.19,23.84 8.77,24.43 8.77,25.86 9.91,27 10.81,27 v11.41,27.6 11.41,27.7 15.51,31.8 22.81,31.8 v23.01,31.6
VBUS
  Top 0.152: MDBT1.32 14.21,18.6 14.31,18.7 14.31,19.23 16.09,21.01 16.09,26.02 13.21,28.9 13.21,29.2 12.51,29.9 12.51,30.7 D2.A
  Top 0.254: 11.01,31.3 11.01,31.15 R3.2 11.06,30 Q2.1 | 11.01,31.3 VBUS.TP | D2.A 12.16,31.3 11.01,31.3 | 12.51,30.7 12.77,30.7 13.55,29.92 16.18,29.92 16.34,30.08 16.34,30.38 17.15,31.18 18.28,31.18 18.61,30.85 U3.4
VDIV
  Top 0.152: R9.2 21.01,32.15 21.01,28.5 20.51,28 19.01,28 18.66,27.65 MDBT1.10
  Top 0.254: R9.2 R6.1
VHI  (via drill 0.4)
  Top 0.254: C1.1 5.56,28.8 U2.1 | U2.1 5.66,27.7 R1.2 | U2.1 5.66,29.95 v5.71,30 | v9.71,28.3 9.66,28.35 | 9.66,28.35 9.16,28.85 Q2.2 | D2.C 12.29,28.43 11.14,28.43 11.05,28.35 9.66,28.35
  Bottom 0.254: v9.71,28.3 7.41,28.3 v5.71,30
VIB  (via drill 0.3, 0.35)
  Top 0.152: 4.29,5.9 4.29,5.62 v5.21,4.7 | v10.21,21.8 10.27,21.7 10.54,21.87 11.27,22.59 12.84,22.59 12.84,22.6 MDBT1.24
  Top 0.254: Q1.1 4.29,5.9 4.29,6.12 R10.2
  Bottom 0.152: v5.21,4.7 6,5.49 6.36,5.49 6.72,5.85 6.72,6.35 6.36,6.71 5.86,6.71 5.7,6.55 4.56,6.55 3.37,7.75 3.37,18.95 3.23,19.09 3.23,20 | 3.23,20.04 3.23,20 | v10.21,21.8 10.06,21.6 9.26,20.8 4.03,20.8 3.23,20

### Text on the board
tPlace: BATT | GND | SDA | SCL | GND | 3V3 | RST | RX | TX | SWD | SWC | K | A | V2.1.1 | SMA-Q2 alternative / mainboard | A. Jordan / 2019